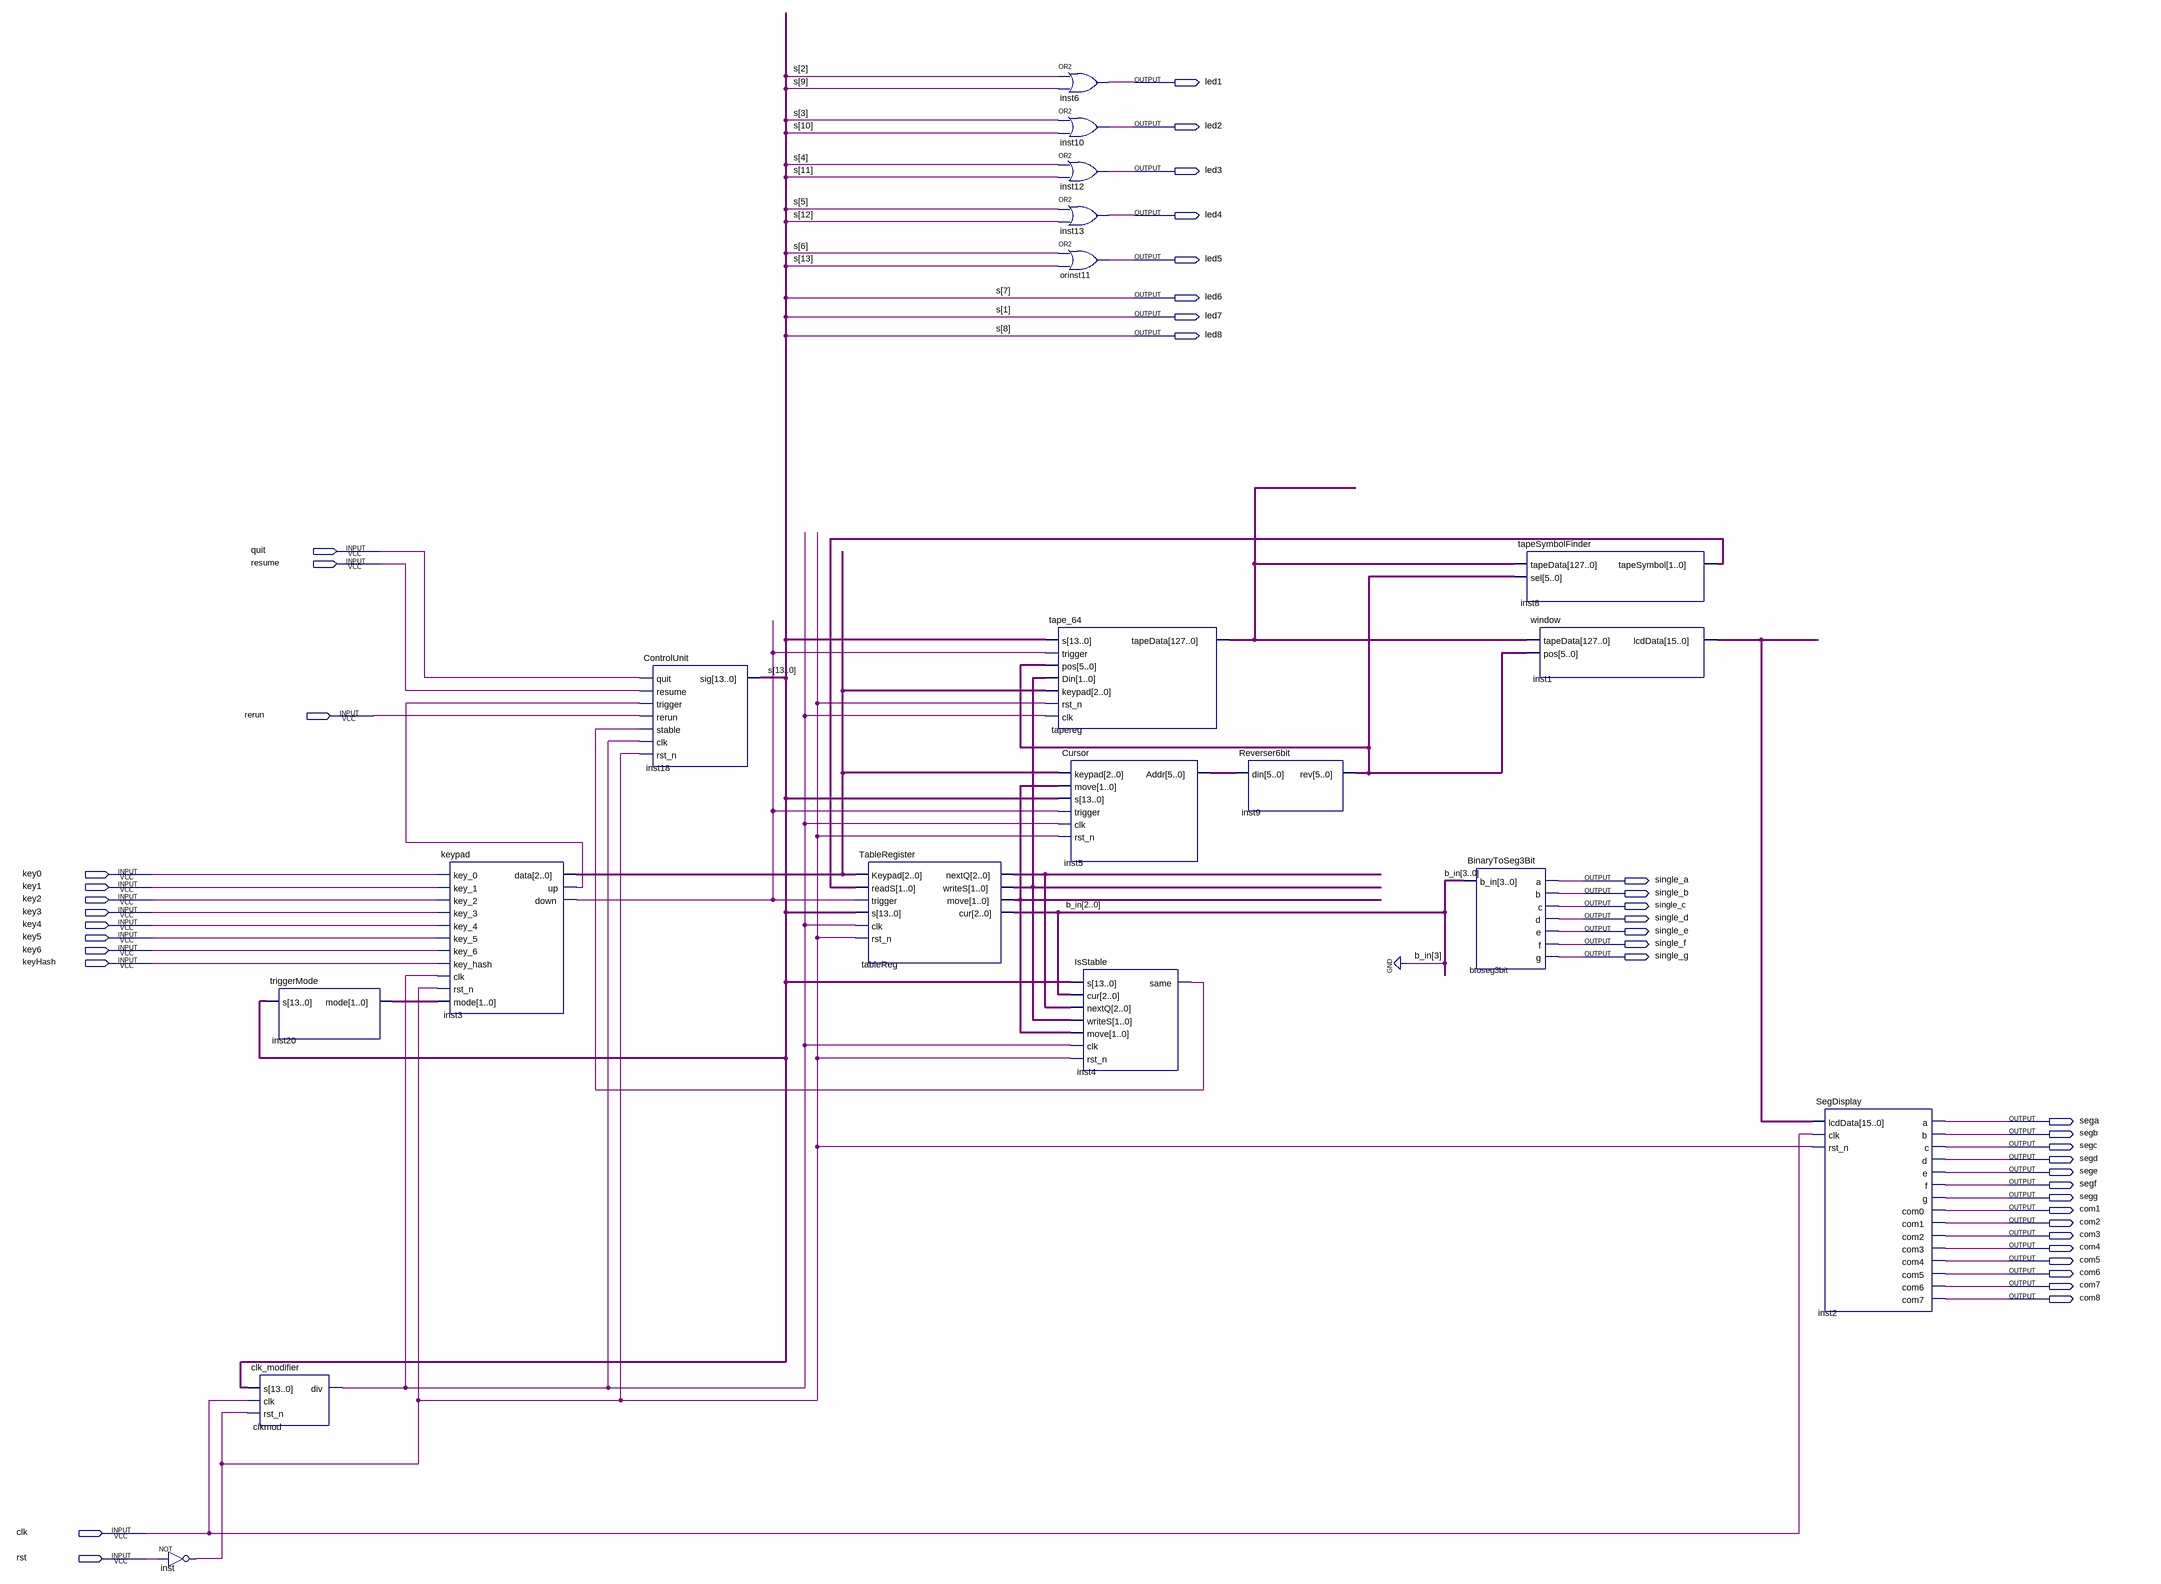
[diagram p0: schematic sheet]
// Quartus schematic TuringMachine.bdf as structural Verilog: 19 symbols, 43 pins
module TuringMachine (
  input  quit,
  input  resume,
  input  rerun,
  input  key0,
  input  key1,
  input  key2,
  input  key3,
  input  key4,
  input  key5,
  input  key6,
  input  keyHash,
  input  clk,
  input  rst,
  output led1,
  output led2,
  output led3,
  output led4,
  output led5,
  output led6,
  output led7,
  output led8,
  output single_a,
  output single_b,
  output single_c,
  output single_d,
  output single_e,
  output single_f,
  output single_g,
  output sega,
  output segb,
  output segc,
  output segd,
  output sege,
  output segf,
  output segg,
  output com1,
  output com2,
  output com3,
  output com4,
  output com5,
  output com6,
  output com7,
  output com8
);

  wire clkmod_div, inst3_down, inst3_up, inst4_same, inst_out;
  wire [1:0] inst8_tapesymbol, inst20_mode, tableReg_move, tableReg_writes;
  wire [2:0] b_in, inst3_data, tableReg_nextq;
  wire [5:0] inst5_addr, inst9_rev;
  wire [13:0] s;
  wire [15:0] inst1_lcddata;
  wire [127:0] tapereg_tapedata;

  not inst (inst_out, rst);
  triggerMode inst20 (.s({s[13:9], led8, led6, s[6:2], led7, s[0]}), .mode(inst20_mode));
  clk_modifier clkmod (.s({s[13:9], led8, led6, s[6:2], led7, s[0]}), .clk(clk), .rst_n(inst_out), .div(clkmod_div));
  keypad inst3 (
    .key_0(key0), .key_1(key1), .key_2(key2), .key_3(key3), .key_4(key4), .key_5(key5), .key_6(key6),
    .key_hash(keyHash), .clk(clkmod_div), .rst_n(inst_out), .mode(inst20_mode), .data(inst3_data),
    .up(inst3_up), .down(inst3_down));
  ControlUnit inst18 (
    .quit(quit), .resume(resume), .trigger(inst3_up), .rerun(rerun), .stable(inst4_same), .clk(clkmod_div),
    .rst_n(inst_out), .sig({s[13:9], led8, led6, s[6:2], led7, s[0]}));
  TableRegister tableReg (
    .Keypad(inst3_data), .readS(inst8_tapesymbol), .trigger(inst3_down),
    .s({s[13:9], led8, led6, s[6:2], led7, s[0]}), .clk(clkmod_div), .rst_n(inst_out),
    .nextQ(tableReg_nextq), .writeS(tableReg_writes), .move(tableReg_move), .cur(b_in));
  or inst6 (led1, s[2], s[9]);
  or inst10 (led2, s[3], s[10]);
  or inst12 (led3, s[4], s[11]);
  or inst13 (led4, s[5], s[12]);
  or orinst11 (led5, s[6], s[13]);
  tape_64 tapereg (
    .s({s[13:9], led8, led6, s[6:2], led7, s[0]}), .trigger(inst3_down), .pos(inst9_rev),
    .Din(tableReg_writes), .keypad(inst3_data), .rst_n(inst_out), .clk(clkmod_div),
    .tapeData(tapereg_tapedata));
  Cursor inst5 (
    .keypad(inst3_data), .move(tableReg_move), .s({s[13:9], led8, led6, s[6:2], led7, s[0]}),
    .trigger(inst3_down), .clk(clkmod_div), .rst_n(inst_out), .Addr(inst5_addr));
  IsStable inst4 (
    .s({s[13:9], led8, led6, s[6:2], led7, s[0]}), .cur(b_in), .nextQ(tableReg_nextq),
    .writeS(tableReg_writes), .move(tableReg_move), .clk(clkmod_div), .rst_n(inst_out), .same(inst4_same));
  Reverser6bit inst9 (.din(inst5_addr), .rev(inst9_rev));
  BinaryToSeg3Bit btoseg3bit (
    .b_in({1'b0, b_in}), .a(single_a), .b(single_b), .c(single_c), .d(single_d), .e(single_e), .f(single_f),
    .g(single_g));
  tapeSymbolFinder inst8 (.tapeData(tapereg_tapedata), .sel(inst9_rev), .tapeSymbol(inst8_tapesymbol));
  window inst1 (.tapeData(tapereg_tapedata), .pos(inst9_rev), .lcdData(inst1_lcddata));
  SegDisplay inst2 (
    .lcdData(inst1_lcddata), .clk(clk), .rst_n(inst_out), .a(sega), .b(segb), .c(segc), .d(segd), .e(sege),
    .f(segf), .g(segg), .com0(com1), .com1(com2), .com2(com3), .com3(com4), .com4(com5), .com5(com6),
    .com6(com7), .com7(com8));

  // Other names for the same wires on the sheet: s (some bits) = {led8, led6, led7}
endmodule
